# EAGLE schematic de0-nano_RMII (EAGLE 7.6.0)
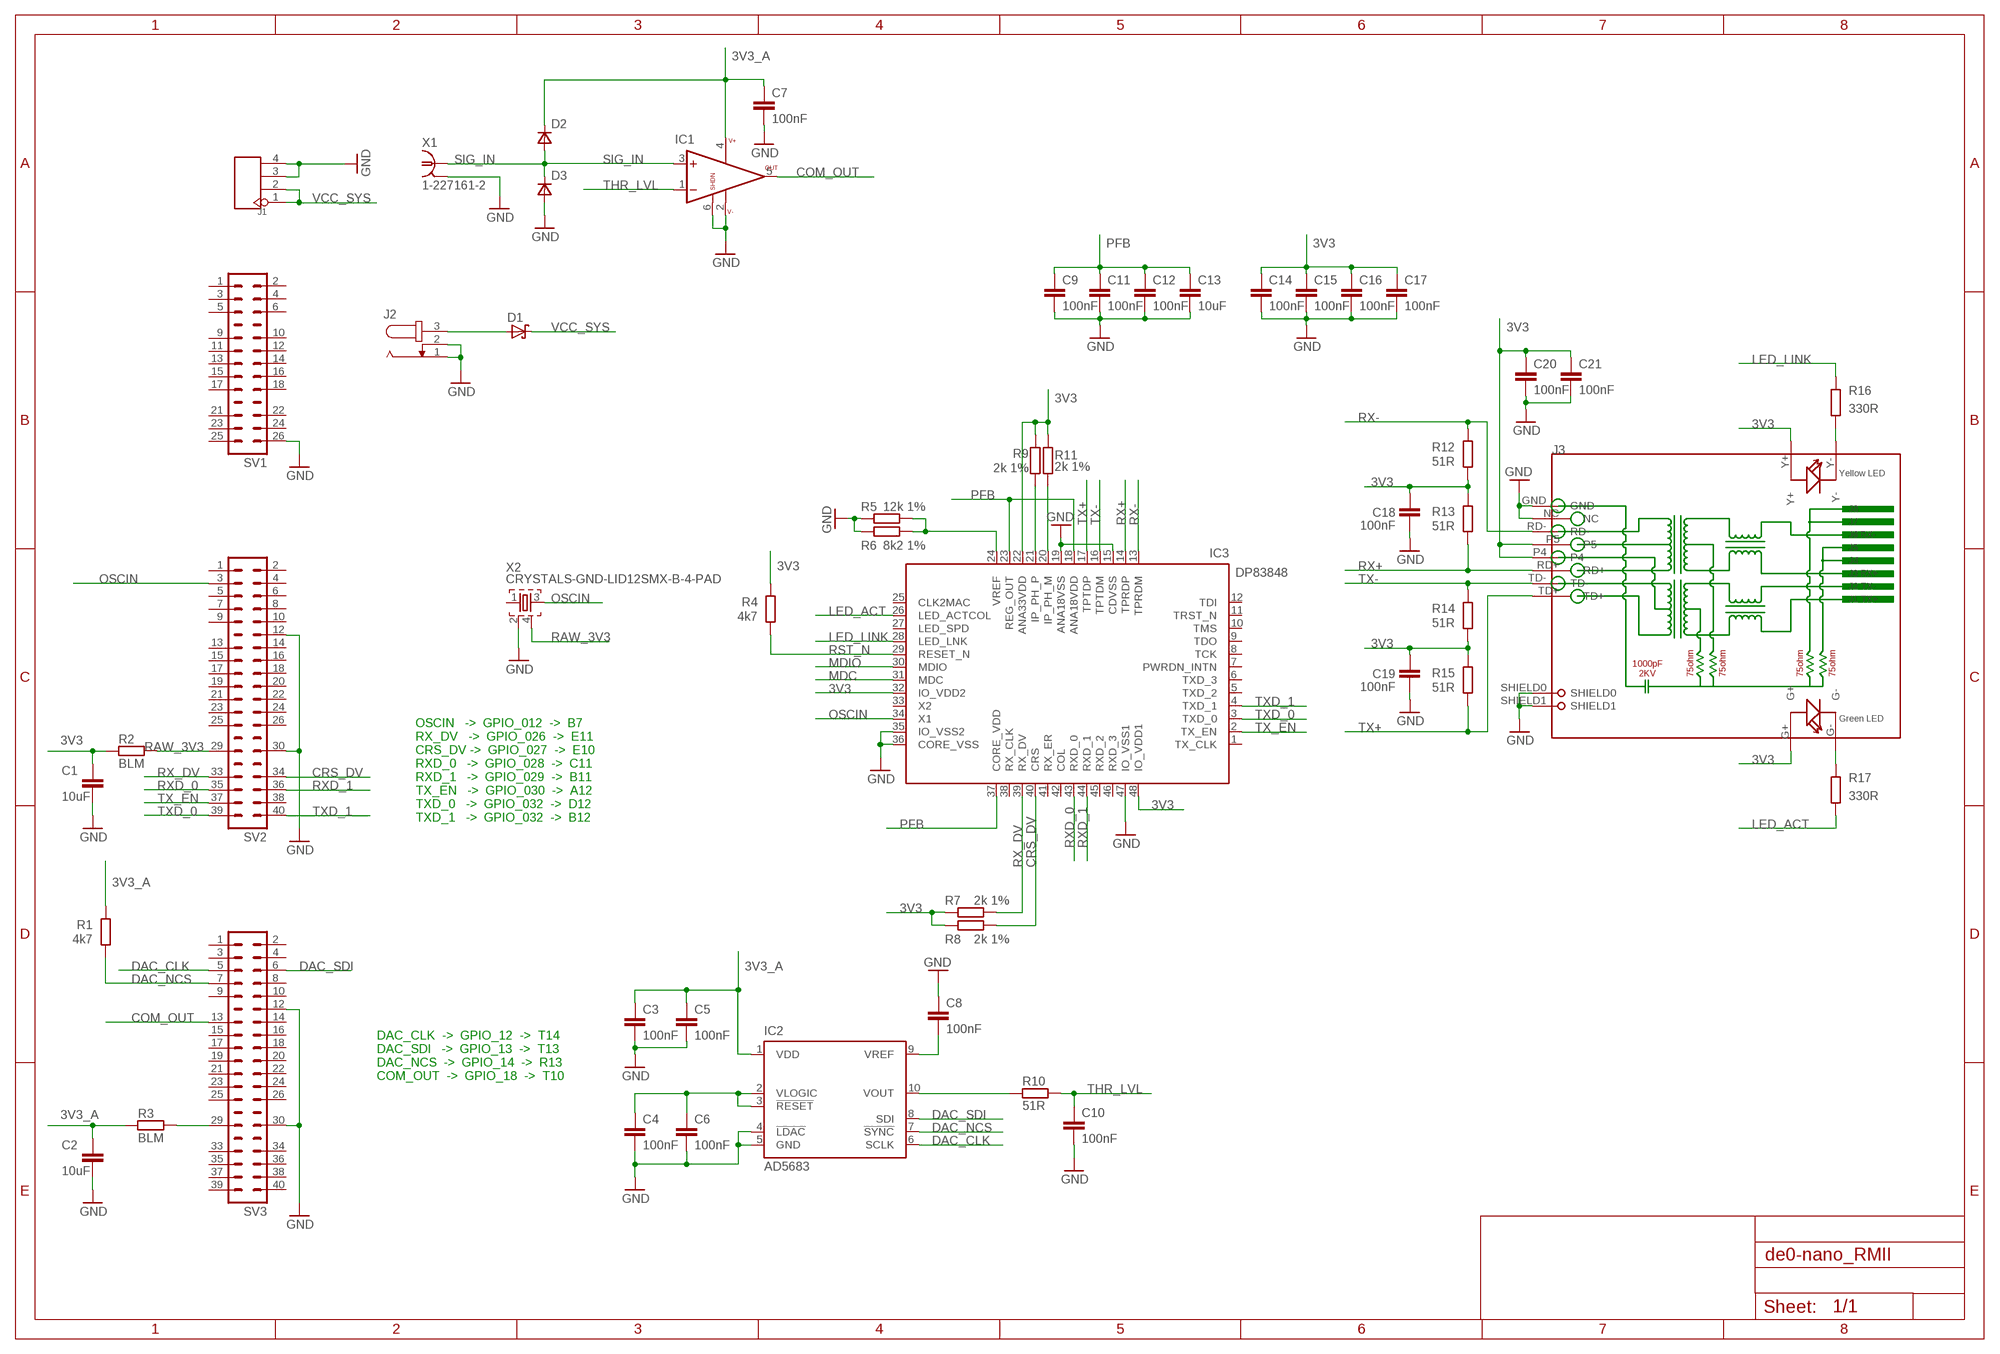
[diagram p0: schematic, sheet 1]

## Parts
C1  10uF  C-EUC0805  [C0805]
C2  10uF  C-EUC0805  [C0805]
C3  100nF  C-EUC0603  [C0603]
C4  100nF  C-EUC0603  [C0603]
C5  100nF  C-EUC0603  [C0603]
C6  100nF  C-EUC0603  [C0603]
C7  100nF  C-EUC0603  [C0603]
C8  100nF  C-EUC0603  [C0603]
C9  100nF  C-EUC0603  [C0603]
C10  100nF  C-EUC0603  [C0603]
C11  100nF  C-EUC0603  [C0603]
C12  100nF  C-EUC0603  [C0603]
C13  10uF  C-EUC0805  [C0805]
C14  100nF  C-EUC0603  [C0603]
C15  100nF  C-EUC0603  [C0603]
C16  100nF  C-EUC0603  [C0603]
C17  100nF  C-EUC0603  [C0603]
C18  100nF  C-EUC0603  [C0603]
C19  100nF  C-EUC0603  [C0603]
C20  100nF  C-EUC0603  [C0603]
C21  100nF  C-EUC0603  [C0603]
D1  SCHOTTKY-DIODESMC  [SMC]
D2  DSOD323  [SOD323]
D3  DSOD323  [SOD323]
IC1  LT1719  [TSOT23-6]
IC2  AD5683  [SO10]
IC3  DP83848  [LQFP48]
J1  HEADER-4P-60/35MIL  [4P-65/35MIL]
J2  JACK-PLUG1  [SPC4078]
J3  RJ45-HR911105A-HR911105A  [RJ45]
R1  4k7  R-EU_R0603  [R0603]
R2  BLM  R-EU_R0603  [R0603]
R3  BLM  R-EU_R0603  [R0603]
R4  4k7  R-EU_R0603  [R0603]
R5  12k 1%  R-EU_R0603  [R0603]
R6  8k2 1%  R-EU_R0603  [R0603]
R7  2k 1%  R-EU_R0603  [R0603]
R8  2k 1%  R-EU_R0603  [R0603]
R9  2k 1%  R-EU_R0603  [R0603]
R10  51R  R-EU_R0603  [R0603]
R11  2k 1%  R-EU_R0603  [R0603]
R12  51R  R-EU_R0603  [R0603]
R13  51R  R-EU_R0603  [R0603]
R14  51R  R-EU_R0603  [R0603]
R15  51R  R-EU_R0603  [R0603]
R16  330R  R-EU_R0603  [R0603]
R17  330R  R-EU_R0603  [R0603]
SV1  MA13-2_ALT  [MA13-2_ALT]
SV2  MA20-2_ALT  [MA20-2_ALT]
SV3  MA20-2_ALT  [MA20-2_ALT]
X1  1-227161-2  [AMP_227161]
X2  CRYSTALS-GND-LID12SMX-B-4-PAD  [7.5X5-4-PAD]

## Nets
3V3: C1.1 C14.1 C15.1 C16.1 C17.1 C18.1 C19.1 C20.1 C21.1 IC3.22(ANA33VDD) IC3.32(IO_VDD2) IC3.48(IO_VDD1) J3.G+ J3.P4 J3.P5 J3.Y+ R2.1 R4.1 R7.2 R8.2 R9.2 R11.2 R12.2 R13.1 R14.2 R15.1
3V3_A: C2.1 C3.1 C5.1 C7.1 D2.1(C) IC1.4(V+) IC2.1(VDD) R1.1 R3.1
COM_OUT: IC1.5(OUT) SV3.13
CRS_DV: IC3.40(CRS) R8.1 SV2.34
DAC_CLK: IC2.6(SCLK) SV3.5
DAC_NCS: IC2.7(!SYNC) R1.2 SV3.7
DAC_SDI: IC2.8(SDI) SV3.6
GND: C1.2 C2.2 C3.2 C4.2 C5.2 C6.2 C7.2 C8.2 C9.2 C10.2 C11.2 C12.2 C13.2 C14.2 C15.2 C16.2 C17.2 C18.2 C19.2 C20.2 C21.2 D3.2(A) IC1.2(V-) IC1.6(SHDN) IC2.4(!LDAC) IC2.5(GND) IC3.15(CDVSS) IC3.19(ANA18VSS) IC3.35(IO_VSS2) IC3.36(CORE_VSS) IC3.47(IO_VSS1) J1.3 J1.4 J2.1 J2.2 J3.GND J3.NC J3.SHIELD0 J3.SHIELD1 R5.2 R6.2 SV1.26 SV2.12 SV2.30 SV3.12 SV3.30 X1.2 X2.2
LED_ACT: IC3.26(LED_ACTCOL) R17.1
LED_LINK: IC3.28(LED_LNK) R16.2
MDC: IC3.31(MDC)
MDIO: IC3.30(MDIO)
N$1: R3.2 SV3.29
N$3: IC3.21(IP_PH_P) R9.1
N$4: J3.Y- R16.1
N$5: IC3.20(IP_PH_M) R11.1
N$6: J3.G- R17.2
N$8: IC2.10(VOUT) R10.1
N$9: IC3.24(VREF) R5.1 R6.1
N$13: C8.1 IC2.9(VREF)
OSCIN: IC3.34(X1) SV2.3 X2.3
PFB: C9.1 C11.1 C12.1 C13.1 IC3.18(ANA18VDD) IC3.23(REG_OUT) IC3.37(CORE_VDD)
RAW_3V3: R2.2 SV2.29 X2.4
RST_N: IC3.29(RESET_N) R4.2
RX+: IC3.14(TPRDP) J3.RD+ R13.2
RX-: IC3.13(TPRDM) J3.RD- R12.1
RX_DV: IC3.39(RX_DV) R7.1 SV2.33
RXD_0: IC3.43(RXD_0) SV2.35
RXD_1: IC3.44(RXD_1) SV2.36
SIG_IN: D2.2(A) D3.1(C) IC1.3(+IN) X1.1
THR_LVL: C10.1 IC1.1(-IN) R10.2
TX+: IC3.17(TPTDP) J3.TD+ R15.2
TX-: IC3.16(TPTDM) J3.TD- R14.1
TX_EN: IC3.2(TX_EN) SV2.37
TXD_0: IC3.3(TXD_0) SV2.39
TXD_1: IC3.4(TXD_1) SV2.40
V_RAW: D1.A J2.3
VCC_SYS: D1.C J1.1 J1.2
VLOGIC: C4.1 C6.1 IC2.2(VLOGIC) IC2.3(!RESET)
Unconnected: IC3.1(TX_CLK) IC3.5(TXD_2) IC3.6(TXD_3) IC3.7(PWRDN_INTN) IC3.8(TCK) IC3.9(TDO) IC3.10(TMS) IC3.11(TRST_N) IC3.12(TDI) IC3.25(CLK2MAC) IC3.27(LED_SPD) IC3.33(X2) IC3.38(RX_CLK) IC3.41(RX_ER) IC3.42(COL) IC3.45(RXD_2) IC3.46(RXD_3) SV1.1 SV1.2 SV1.3 SV1.4 SV1.5 SV1.6 SV1.9 SV1.10 SV1.11 SV1.12 SV1.13 SV1.14 SV1.15 SV1.16 SV1.17 SV1.18 SV1.21 SV1.22 SV1.23 SV1.24 SV1.25 SV2.1 SV2.2 SV2.4 SV2.5 SV2.6 SV2.7 SV2.8 SV2.9 SV2.10 SV2.13 SV2.14 SV2.15 SV2.16 SV2.17 SV2.18 SV2.19 SV2.20 SV2.21 SV2.22 SV2.23 SV2.24 SV2.25 SV2.26 SV2.38 SV3.1 SV3.2 SV3.3 SV3.4 SV3.8 SV3.9 SV3.10 SV3.14 SV3.15 SV3.16 SV3.17 SV3.18 SV3.19 SV3.20 SV3.21 SV3.22 SV3.23 SV3.24 SV3.25 SV3.26 SV3.33 SV3.34 SV3.35 SV3.36 SV3.37 SV3.38 SV3.39 SV3.40 X2.1

## Notes on the sheet
- OSCIN   ->  GPIO_012  ->  B7
  RX_DV   ->  GPIO_026  ->  E11
  CRS_DV ->  GPIO_027  ->  E10
  RXD_0   ->  GPIO_028  ->  C11
  RXD_1   ->  GPIO_029  ->  B11
  TX_EN   ->  GPIO_030  ->  A12
  TXD_0   ->  GPIO_032  ->  D12
  TXD_1   ->  GPIO_032  ->  B12
- DAC_CLK  ->  GPIO_12  ->  T14
  DAC_SDI   ->  GPIO_13  ->  T13
  DAC_NCS  ->  GPIO_14  ->  R13
  COM_OUT  ->  GPIO_18  ->  T10

## Library data of the parts
C1-C21 = resistor:C-EU: CAPACITOR, European symbol
D1 = diode:SCHOTTKY-DIODE: Schottky Diode
D2 D3 = zetex:D: DIODE; MPN: CDSOD323-T05C; OC_FARNELL: 1824860; OC_NEWARK: 79R6078
IC1 = linear-technology:LT1719: Ultra-fast precision COMPARATOR
IC2 = analog-devices:AD5683: Low Voltage Microphone Preamplifier with Variable Compression and Noise Gating Source: http://www.analog.com .. SSM2167.pdf; MPN: SSM2167Z-EVAL; OC_FARNELL: 1424672; OC_NEWARK: 65M4647
IC3 = national-semiconductor:DP83848: PHYTER® - Extended Temperature Single Port 10/100 Mb/s Ethernet Physical Layer Transceiver Auto generated by make-symbol-device-package-bsdl.ulp Rev. 34 Source: dp83848yb.bsdl http://www.national.com/ds/DP/DP83848VYB.pdf; MPN: DP83848VYB; OC_FARNELL: 1286817; OC_NEWARK: 11N4484
J1 = seeed_connector:HEADER-4P
J2 = con-jack:JACK-PLUG: DC POWER JACK Power Jack, DC, Right Angle, Through Hole, Rated 5A at 16VDC, PC Terminals Distributor: Farnell (www.Farnell.de) Drawing: 84N1161.pdf / 84N1162.pdf Manufacturer: SPC Technology (www.spctechnology.com) Type: SPC4077 / SPC 4078; OC_FARNELL: unknown; OC_NEWARK: unknown
J3 = seeed_connector:RJ45-HR911105A
R1-R17 = resistor:R-EU_: RESISTOR, European symbol
SV1 = con-lstb:MA13-2_ALT: PIN HEADER
SV2 SV3 = con-lstb:MA20-2_ALT: PIN HEADER
X1 = con-coax:?227161*: JACK, RIGHT ANGLE, 50 OHM, PCB, BNC Source: amp_227161.pdf; OC_FARNELL: unknown; OC_NEWARK: unknown
X2 = IQD-Frequency-Products:CRYSTALS-GND-LID: CRYSTALS WITH CAN GROUNDED